# Altium schematic sheet Sensors.SchDoc
size A4; SheetNumber: 6; SheetTotal: 7
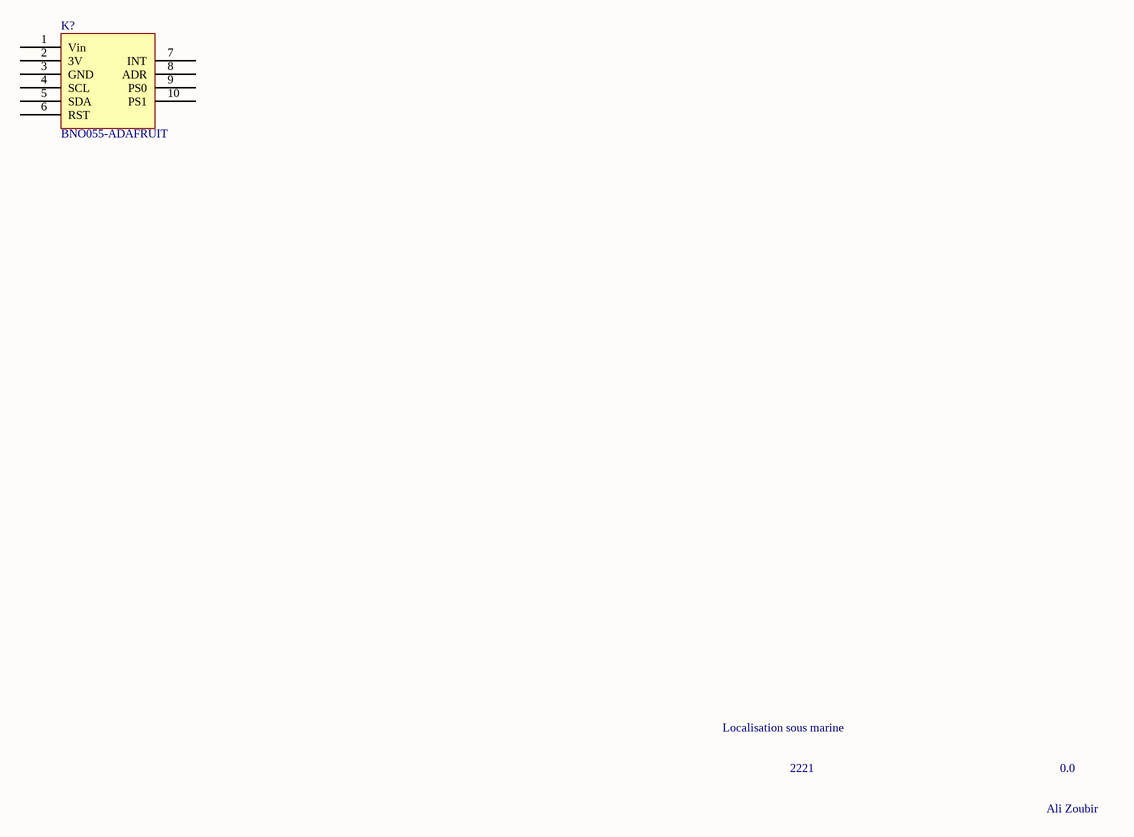
[diagram p0: Sensors.SchDoc]

## Parts
K?  BNO055-ADAFRUIT

## Nets

Not connected (* = marked no-connect by the designer): K? 1(Vin) 2(3V) 3(GND) 4(SCL) 5(SDA) 6(RST) 7(INT) 8(ADR) 9(PS0) 10(PS1)

## Notes on the sheet
- Localisation sous marine
- 2221
- 0.0
- Ali Zoubir